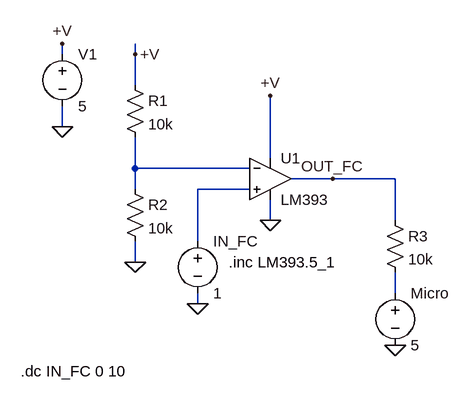
[diagram p0: schematic Final_de_carrera.asc]
Final_de_carrera.asc, the LTspice schematic file:
Version 4
SHEET 1 880 680
WIRE -416 48 -416 32
WIRE -304 48 -304 32
WIRE -304 96 -304 48
WIRE -416 160 -416 128
WIRE -96 208 -96 112
WIRE -304 224 -304 176
WIRE -128 224 -304 224
WIRE 0 240 -64 240
WIRE 96 240 0 240
WIRE -304 256 -304 224
WIRE -128 256 -208 256
WIRE -96 304 -96 272
WIRE 96 304 96 240
WIRE -208 336 -208 256
WIRE -304 368 -304 336
WIRE 96 416 96 384
WIRE -208 432 -208 416
FLAG -416 160 0
FLAG -416 32 +V
FLAG -96 304 0
FLAG 0 240 OUT_FC
FLAG -208 432 0
FLAG -304 368 0
FLAG -304 48 +V
FLAG -96 112 +V
FLAG 96 496 0
SYMBOL voltage -416 32 R0
SYMATTR InstName V1
SYMATTR Value 5
SYMBOL Opamps\\opamp2 -96 176 R0
SYMATTR InstName U1
SYMATTR Value LM393
SYMBOL res -320 80 R0
SYMATTR InstName R1
SYMATTR Value 10k
SYMBOL res -320 240 R0
SYMATTR InstName R2
SYMATTR Value 10k
SYMBOL voltage -208 320 R0
WINDOW 123 0 0 Left 0
WINDOW 39 0 0 Left 0
SYMATTR InstName IN_FC
SYMATTR Value 1
SYMBOL res 80 288 R0
SYMATTR InstName R3
SYMATTR Value 10k
SYMBOL voltage 96 400 R0
WINDOW 123 0 0 Left 0
WINDOW 39 0 0 Left 0
SYMATTR InstName Micro
SYMATTR Value 5
TEXT -160 368 Left 2 !.inc LM393.5_1
TEXT -480 536 Left 2 !.dc IN_FC 0 10

The netlist it stands for:
* Final_de_carrera.asc
V1 +V 0 5
XU1 N002 N001 +V 0 OUT_FC LM393  ; pins In+ In- V+ V- OUT
R1 +V N001 10k
R2 N001 0 10k
V§IN_FC N002 0 1
R3 OUT_FC N003 10k
V§Micro N003 0 5
.inc LM393.5_1
.dc IN_FC 0 10
.backanno
.end